# Altium project LED_ind.PrjPcb
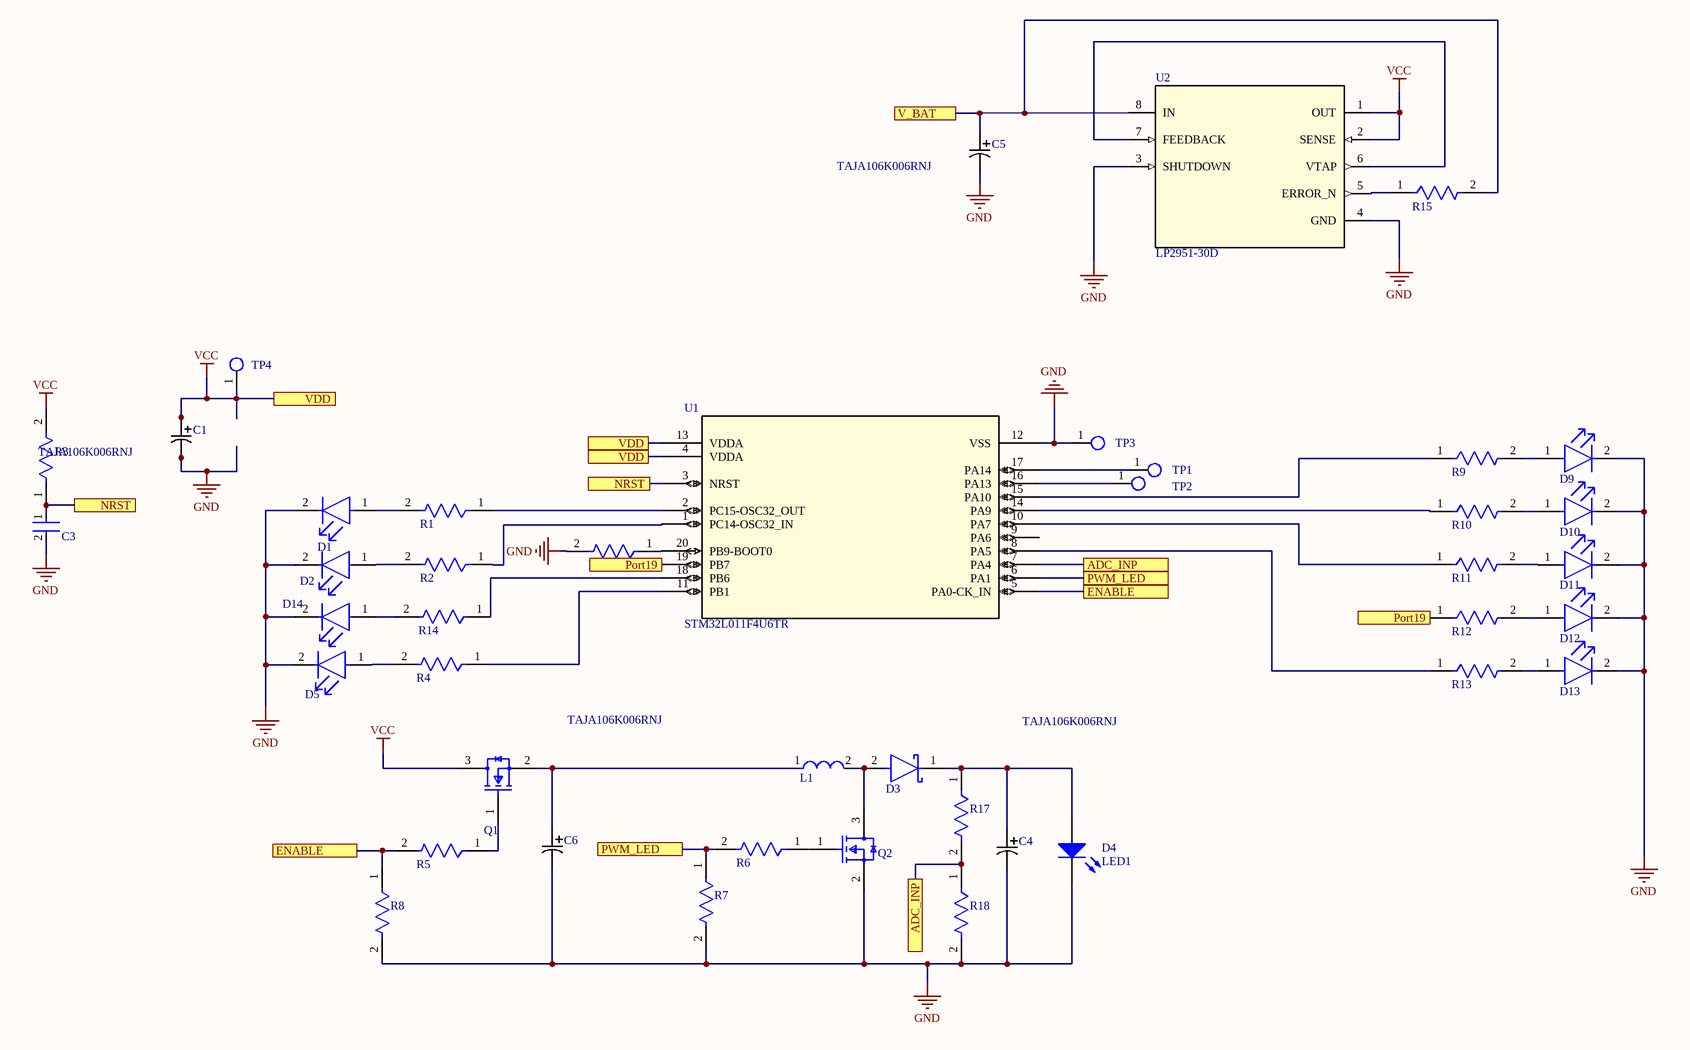
[diagram p0: LED_ind.SchDoc]
1 sheet, 43 parts. Net scope: flat (ports and power ports of the same name join across sheets).
Board file: LED_ind.PcbDoc

## Sheet LED_ind.SchDoc
size A1; SheetNumber: 1; SheetTotal: 1

### Parts
C1  TAJA106K006RNJ  [TAJA_AVX-L]
C3  C0805C104J4RACTU  [Kemet_C0402-BB_IPC_A]  (value not drawn)
C4  TAJA106K006RNJ  [TAJA_AVX-L]
C5  TAJA106K006RNJ  [TAJA_AVX-L]
C6  TAJA106K006RNJ  [TAJA_AVX-L]
D1  SML-LX1206GC-TR  [Wurth_Electronics_0_MFG]  (value not drawn)
D2  SML-LX1206GC-TR  [Wurth_Electronics_0_MFG]  (value not drawn)
D3  1PS79SB30_115  [On_Semiconductor_502-01_MFG]  (value not drawn)
D4  LED1  [LED-1]
D5  SML-LX1206GC-TR  [Wurth_Electronics_0_MFG]  (value not drawn)
D9  SML-LX1206GC-TR  [Wurth_Electronics_0_MFG]  (value not drawn)
D10  SML-LX1206GC-TR  [Wurth_Electronics_0_MFG]  (value not drawn)
D11  SML-LX1206GC-TR  [Wurth_Electronics_0_MFG]  (value not drawn)
D12  SML-LX1206GC-TR  [Wurth_Electronics_0_MFG]  (value not drawn)
D13  SML-LX1206GC-TR  [Wurth_Electronics_0_MFG]  (value not drawn)
D14  SML-LX1206GC-TR  [Wurth_Electronics_0_MFG]  (value not drawn)
L1  LQH32CN2R2M33L  [Murata_LQH32CH_23_MFG]  (value not drawn)
Q1  BSS138W  [SOT65P210X110-3N]  (value not drawn)
Q2  BSS138W  [SOT65P210X110-3N]  (value not drawn)
R1  100  [Vishay_CRCW0402-e3_IPC_C]  (value not drawn)
R2  100  [Vishay_CRCW0402-e3_IPC_C]  (value not drawn)
R3  10K  [Vishay_CRCW0402-e3_IPC_C]  (value not drawn)
R4  CRCW06031K00FKEA  [Vishay_CRCW0402-e3_IPC_C]  (value not drawn)
R5  CRCW06031K00FKEA  [Vishay_CRCW0402-e3_IPC_C]  (value not drawn)
R6  CRCW06031K00FKEA  [Vishay_CRCW0402-e3_IPC_C]  (value not drawn)
R7  CRCW06031K00FKEA  [Vishay_CRCW0402-e3_IPC_C]  (value not drawn)
R8  CRCW06031K00FKEA  [Vishay_CRCW0402-e3_IPC_C]  (value not drawn)
R9  CRCW06031K00FKEA  [Vishay_CRCW0402-e3_IPC_C]  (value not drawn)
R10  CRCW06031K00FKEA  [Vishay_CRCW0402-e3_IPC_C]  (value not drawn)
R11  CRCW06031K00FKEA  [Vishay_CRCW0402-e3_IPC_C]  (value not drawn)
R12  CRCW06031K00FKEA  [Vishay_CRCW0402-e3_IPC_C]  (value not drawn)
R13  CRCW06031K00FKEA  [Vishay_CRCW0402-e3_IPC_C]  (value not drawn)
R14  CRCW06031K00FKEA  [Vishay_CRCW0402-e3_IPC_C]  (value not drawn)
R15  CRCW06031K00FKEA  [Vishay_CRCW0402-e3_IPC_C]  (value not drawn)
R17  CRCW06031K00FKEA  [Vishay_CRCW0402-e3_IPC_C]  (value not drawn)
R18  CRCW06031K00FKEA  [Vishay_CRCW0402-e3_IPC_C]  (value not drawn)
R19  10K  [Vishay_CRCW0402-e3_IPC_A]  (value not drawn)
TP1  Test_Point_PCB  [Test_Point]  (value not drawn)
TP2  Test_Point_PCB  [Test_Point]  (value not drawn)
TP3  Test_Point_PCB  [Test_Point]  (value not drawn)
TP4  Test_Point_PCB  [Test_Point]  (value not drawn)
U1  STM32L011F4U6TR  [UFQFPN20_3x3x0p6]
U2  LP2951-30D  [D0008A_N]

### Ports
ADC_INP, ENABLE, NRST, Port19, PWM_LED, V_BAT, VDD

### Nets
GND: C1.2 C3.2 C4.2 C5.2 C6.2 D1.2(C) D2.2(C) D4.2(K) D5.2(C) D9.2(C) D10.2(C) D11.2(C) D12.2(C) D13.2(C) D14.2(C) Q2.2(S) R7.2 R8.2 R18.2 R19.2 TP3.1(G9) U1.12(VSS) U2.3(SHUTDOWN) U2.4(GND)
VCC: C1.1 Q1.3(D) R3.2 TP4.1(G9) U1.4(VDDA) U1.13(VDDA) U2.1(OUT) U2.2(SENSE) ; port VDD
NetC3_1: C3.1 R3.1 U1.3(NRST) ; port NRST
NetC4_1: C4.1 D3.1(C) D4.1(A) R17.1
NetC5_1: C5.1 R15.2 U2.8(IN) ; port V_BAT
NetC6_1: C6.1 L1.1 Q1.2(S)
NetD1_1: D1.1(A) R1.2
NetD2_1: D2.1(A) R2.2
NetD3_2: D3.2(A) L1.2 Q2.3(D)
NetD5_1: D5.1(A) R4.2
NetD9_1: D9.1(A) R9.2
NetD10_1: D10.1(A) R10.2
NetD11_1: D11.1(A) R11.2
NetD12_1: D12.1(A) R12.2
NetD13_1: D13.1(A) R13.2
NetD14_1: D14.1(A) R14.2
NetQ1_1: Q1.1(G) R5.1
NetQ2_1: Q2.1(G) R6.1
NetR1_1: R1.1 U1.2(PC15-OSC32_OUT)
NetR2_1: R2.1 U1.1(PC14-OSC32_IN)
NetR4_1: R4.1 U1.11(PB1)
NetR5_2: R5.2 R8.1 U1.5(PA0-CK_IN) ; port ENABLE
NetR6_2: R6.2 R7.1 U1.6(PA1) ; port PWM_LED
NetR9_1: R9.1 U1.15(PA10)
NetR10_1: R10.1 U1.14(PA9)
NetR11_1: R11.1 U1.10(PA7)
NetR12_1: R12.1 U1.19(PB7) ; port Port19
NetR13_1: R13.1 U1.8(PA5)
NetR14_1: R14.1 U1.18(PB6)
NetR15_1: R15.1 U2.5(ERROR_N)
NetR17_2: R17.2 R18.1 U1.7(PA4) ; port ADC_INP
NetR19_1: R19.1 U1.20(PB9-BOOT0)
NetTP1_1: TP1.1(G9) U1.17(PA14)
NetTP2_1: TP2.1(G9) U1.16(PA13)
NetU2_6: U2.6(VTAP) U2.7(FEEDBACK)

Not connected (* = marked no-connect by the designer): U1 9(PA6)

### Library data of the parts
C1 C4-C6 = TAJA106K006RNJ: No Description Available; Mfr_Name: KYOCERA AVX; Type: DEV; Copyright: Copyright (C) 2022 Ultra Librarian. All rights reserved.; Manufacturer_Part_Number: TAJA106K006RNJ; RefDes: RefDes
D4 = LED1: Typical RED GaAs LED; Published: 8-Jun-2000; LatestRevisionDate: 08-Jul-2005; LatestRevisionNote: Mech Layer 1 removed.; PackageReference: LED-1; Publisher: Altium Limited; PackageDescription: LED; 2 Leads
R1-R3 R19 = CRCW06031K00FKEA
R4 R9-R15 = CRCW06031K00FKEA: 100
R5 R6 = CRCW06031K00FKEA: 1K
R7 R8 = CRCW06031K00FKEA: 47K
R17 = CRCW06031K00FKEA: 20K
R18 = CRCW06031K00FKEA: 100K
TP1-TP4 = TP_PCB?: Test_Point
U1 = STM32L011F4U6TR: No Description Available; Mfr_Name: STMicroelectronics; Copyright: Copyright (C) 2022 Ultra Librarian. All rights reserved.; Manufacturer_Part_Number: STM32L011F4U6TR; RefDes: RefDes; Type: DEV
U2 = LP2951-30D: No Description Available; Mfr_Name: Texas Instruments; Type: DEV; RefDes: RefDes; Copyright: Copyright (C) 2022 Ultra Librarian. All rights reserved.; Manufacturer_Part_Number: LP2951-30D